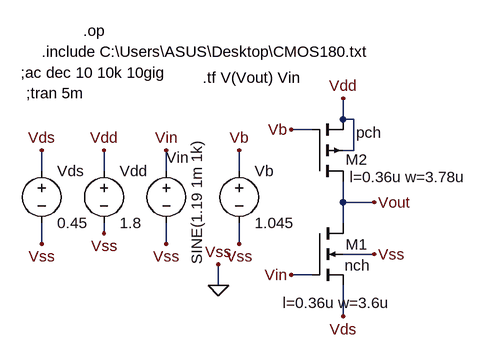
[diagram p0: schematic CSA_opamp_stage_1.asc]
CSA_opamp_stage_1.asc, the LTspice schematic file:
Version 4
SHEET 1 880 680
WIRE 160 16 160 -16
WIRE 176 16 160 16
WIRE 112 32 80 32
WIRE 176 64 176 16
WIRE 176 64 160 64
WIRE -304 96 -304 64
WIRE -208 96 -208 64
WIRE -112 96 -112 64
WIRE 0 96 0 64
WIRE 160 144 160 112
WIRE 208 144 160 144
WIRE 160 176 160 144
WIRE -208 192 -208 176
WIRE -304 208 -304 176
WIRE -112 208 -112 176
WIRE 0 208 0 176
WIRE 208 224 160 224
WIRE 112 256 80 256
WIRE -32 272 -32 240
WIRE 160 320 160 272
FLAG 160 -16 Vdd
FLAG 208 224 Vss
FLAG 208 144 Vout
FLAG 80 32 Vb
FLAG 80 256 Vin
FLAG -32 272 0
FLAG -32 240 Vss
FLAG -208 192 Vss
FLAG -208 64 Vdd
FLAG -112 64 Vin
FLAG -112 208 Vss
FLAG 0 64 Vb
FLAG 0 208 Vss
FLAG -304 64 Vds
FLAG -304 208 Vss
FLAG 160 320 Vds
SYMBOL nmos4 112 176 R0
WINDOW 0 52 33 Left 2
WINDOW 3 50 65 Left 2
WINDOW 123 -45 123 Left 2
SYMATTR InstName M1
SYMATTR Value nch
SYMATTR Value2 l=0.36u w=3.6u
SYMBOL pmos4 112 112 M180
WINDOW 123 58 7 Left 2
WINDOW 0 52 34 Left 2
WINDOW 3 68 75 Left 2
SYMATTR Value2 l=0.36u w=3.78u
SYMATTR InstName M2
SYMATTR Value pch
SYMBOL voltage -208 80 R0
WINDOW 123 0 0 Left 0
WINDOW 39 0 0 Left 0
SYMATTR InstName Vdd
SYMATTR Value 1.8
SYMBOL voltage -112 80 R0
WINDOW 123 0 0 Left 0
WINDOW 39 0 0 Left 0
WINDOW 0 0 -5 Left 2
WINDOW 3 47 -32 VRight 2
SYMATTR InstName Vin
SYMATTR Value SINE(1.19 1m 1k)
SYMBOL voltage 0 80 R0
WINDOW 123 0 0 Left 0
WINDOW 39 0 0 Left 0
SYMATTR InstName Vb
SYMATTR Value 1.045
SYMBOL voltage -304 80 R0
WINDOW 123 0 0 Left 0
WINDOW 39 0 0 Left 0
SYMATTR InstName Vds
SYMATTR Value 0.45
TEXT -304 -88 Left 2 !.include C:\\Users\\ASUS\\Desktop\\CMOS180.txt
TEXT -56 -48 Left 2 !.tf V(Vout) Vin
TEXT -336 -56 Left 2 !;ac dec 10 10k 10gig
TEXT -328 -24 Left 2 !;tran 5m
TEXT -240 -120 Left 2 !.op

The netlist it stands for:
* CSA_opamp_stage_1.asc
M1 Vout Vin Vds 0 nch l=0.36u w=3.6u
M2 Vout Vb Vdd Vdd pch l=0.36u w=3.78u
Vdd Vdd 0 1.8
Vin Vin 0 SINE(1.19 1m 1k)
Vb Vb 0 1.045
Vds Vds 0 0.45
.model NMOS NMOS
.model PMOS PMOS
.lib standard.mos
.include C:\Users\ASUS\Desktop\CMOS180.txt
.tf V(Vout) Vin
;ac dec 10 10k 10gig
;tran 5m
.op
.backanno
.end